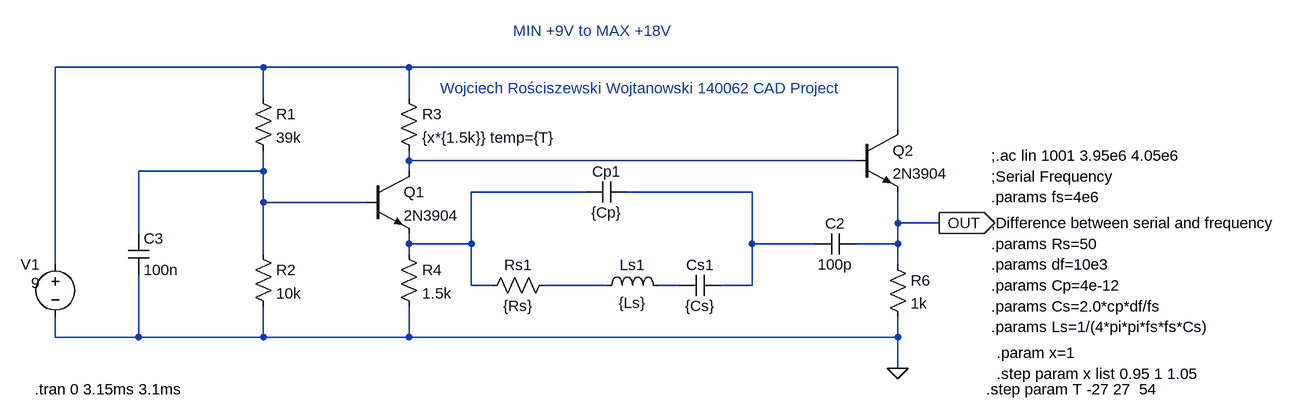
[diagram p0: schematic 5.2 Oscillator Circuit Parametric R3 with Temperature.asc]
5.2 Oscillator Circuit Parametric R3 with Temperature.asc, the LTspice schematic file:
Version 4
SHEET 1 2316 864
WIRE -144 128 -464 128
WIRE 80 128 -144 128
WIRE 832 128 80 128
WIRE -144 176 -144 128
WIRE 80 176 80 128
WIRE 832 224 832 128
WIRE 80 272 80 256
WIRE 768 272 80 272
WIRE -144 288 -144 256
WIRE -144 288 -336 288
WIRE 80 288 80 272
WIRE 352 320 176 320
WIRE 608 320 416 320
WIRE -144 336 -144 288
WIRE 16 336 -144 336
WIRE 832 368 832 320
WIRE 896 368 832 368
WIRE -336 384 -336 288
WIRE 80 400 80 384
WIRE 176 400 176 320
WIRE 176 400 80 400
WIRE 608 400 608 320
WIRE 704 400 608 400
WIRE 832 400 832 368
WIRE 832 400 768 400
WIRE -144 416 -144 336
WIRE 80 416 80 400
WIRE -464 432 -464 128
WIRE 832 432 832 400
WIRE 176 464 176 400
WIRE 208 464 176 464
WIRE 384 464 288 464
WIRE 496 464 464 464
WIRE 608 464 608 400
WIRE 608 464 560 464
WIRE -464 544 -464 512
WIRE -336 544 -336 448
WIRE -336 544 -464 544
WIRE -144 544 -144 496
WIRE -144 544 -336 544
WIRE 80 544 80 496
WIRE 80 544 -144 544
WIRE 832 544 832 512
WIRE 832 544 80 544
WIRE 832 592 832 544
FLAG 896 368 OUT
IOPIN 896 368 Out
FLAG 832 592 0
SYMBOL cap -352 384 R0
SYMATTR InstName C3
SYMATTR Value 100n
SYMBOL res -160 400 R0
SYMATTR InstName R2
SYMATTR Value 10k
SYMBOL res -160 160 R0
SYMATTR InstName R1
SYMATTR Value 39k
SYMBOL res 64 160 R0
SYMATTR InstName R3
SYMATTR Value {x*{1.5k}} temp={T}
SYMBOL res 64 400 R0
SYMATTR InstName R4
SYMATTR Value 1.5k
SYMBOL npn 16 288 R0
SYMATTR InstName Q1
SYMATTR Value 2N3904
SYMBOL res 816 416 R0
SYMATTR InstName R6
SYMATTR Value 1k
SYMBOL cap 768 384 R90
WINDOW 0 0 32 VBottom 2
WINDOW 3 32 32 VTop 2
SYMATTR InstName C2
SYMATTR Value 100p
SYMBOL voltage -464 416 M0
WINDOW 3 24 44 Left 2
WINDOW 123 24 -12 Left 2
WINDOW 39 0 0 Left 0
SYMATTR Value 9
SYMATTR InstName V1
SYMBOL res 192 480 R270
WINDOW 0 32 56 VTop 2
WINDOW 3 0 56 VBottom 2
SYMATTR InstName Rs1
SYMATTR Value {Rs}
SYMBOL cap 352 336 R270
WINDOW 0 32 32 VTop 2
WINDOW 3 0 32 VBottom 2
SYMATTR InstName Cp1
SYMATTR Value {Cp}
SYMBOL cap 496 480 R270
WINDOW 0 32 32 VTop 2
WINDOW 3 0 32 VBottom 2
SYMATTR InstName Cs1
SYMATTR Value {Cs}
SYMBOL ind 368 480 R270
WINDOW 0 32 56 VTop 2
WINDOW 3 5 56 VBottom 2
SYMATTR InstName Ls1
SYMATTR Value {Ls}
SYMBOL npn 768 224 R0
SYMATTR InstName Q2
SYMATTR Value 2N3904
TEXT 128 160 Left 2 ;Wojciech Rościszewski Wojtanowski 140062 CAD Project
TEXT 240 72 Left 2 ;MIN +9V to MAX +18V
TEXT 976 328 Left 2 !.params fs=4e6
TEXT 976 296 Left 2 !;Serial Frequency
TEXT 976 368 Left 2 !;Difference between serial and frequency
TEXT 976 400 Left 2 !.params Rs=50
TEXT 976 432 Left 2 !.params df=10e3
TEXT 976 464 Left 2 !.params Cp=4e-12
TEXT 976 496 Left 2 !.params Cs=2.0*cp*df/fs
TEXT 976 528 Left 2 !.params Ls=1/(4*pi*pi*fs*fs*Cs)
TEXT 976 264 Left 2 !;.ac lin 1001 3.95e6 4.05e6
TEXT -496 624 Left 2 !.tran 0 3.15ms 3.1ms
TEXT 984 568 Left 2 !.param x=1
TEXT 984 600 Left 2 !.step param x list 0.95 1 1.05
TEXT 968 624 Left 2 !.step param T -27 27  54

The netlist it stands for:
* 5.2 Oscillator Circuit Parametric R3 with Temperature.asc
C3 N003 0 100n
R2 N003 0 10k
R1 N001 N003 39k
R3 N001 N002 {x*{1.5k}} temp={T}
R4 N004 0 1.5k
Q1 N002 N003 N004 0 2N3904
R6 OUT 0 1k
C2 OUT N005 100p
V1 N001 0 9
Rs1 N004 N006 {Rs}
Cp1 N004 N005 {Cp}
Cs1 N007 N005 {Cs}
Ls1 N006 N007 {Ls}
Q2 N001 N002 OUT 0 2N3904
.model NPN NPN
.model PNP PNP
.lib standard.bjt
* Wojciech Rościszewski Wojtanowski 140062 CAD Project
* MIN +9V to MAX +18V
.params fs=4e6
;Serial Frequency
;Difference between serial and frequency
.params Rs=50
.params df=10e3
.params Cp=4e-12
.params Cs=2.0*cp*df/fs
.params Ls=1/(4*pi*pi*fs*fs*Cs)
;.ac lin 1001 3.95e6 4.05e6
.tran 0 3.15ms 3.1ms
.param x=1
.step param x list 0.95 1 1.05
.step param T -27 27  54
.backanno
.end